# EAGLE schematic SIH (EAGLE 9.6.2)
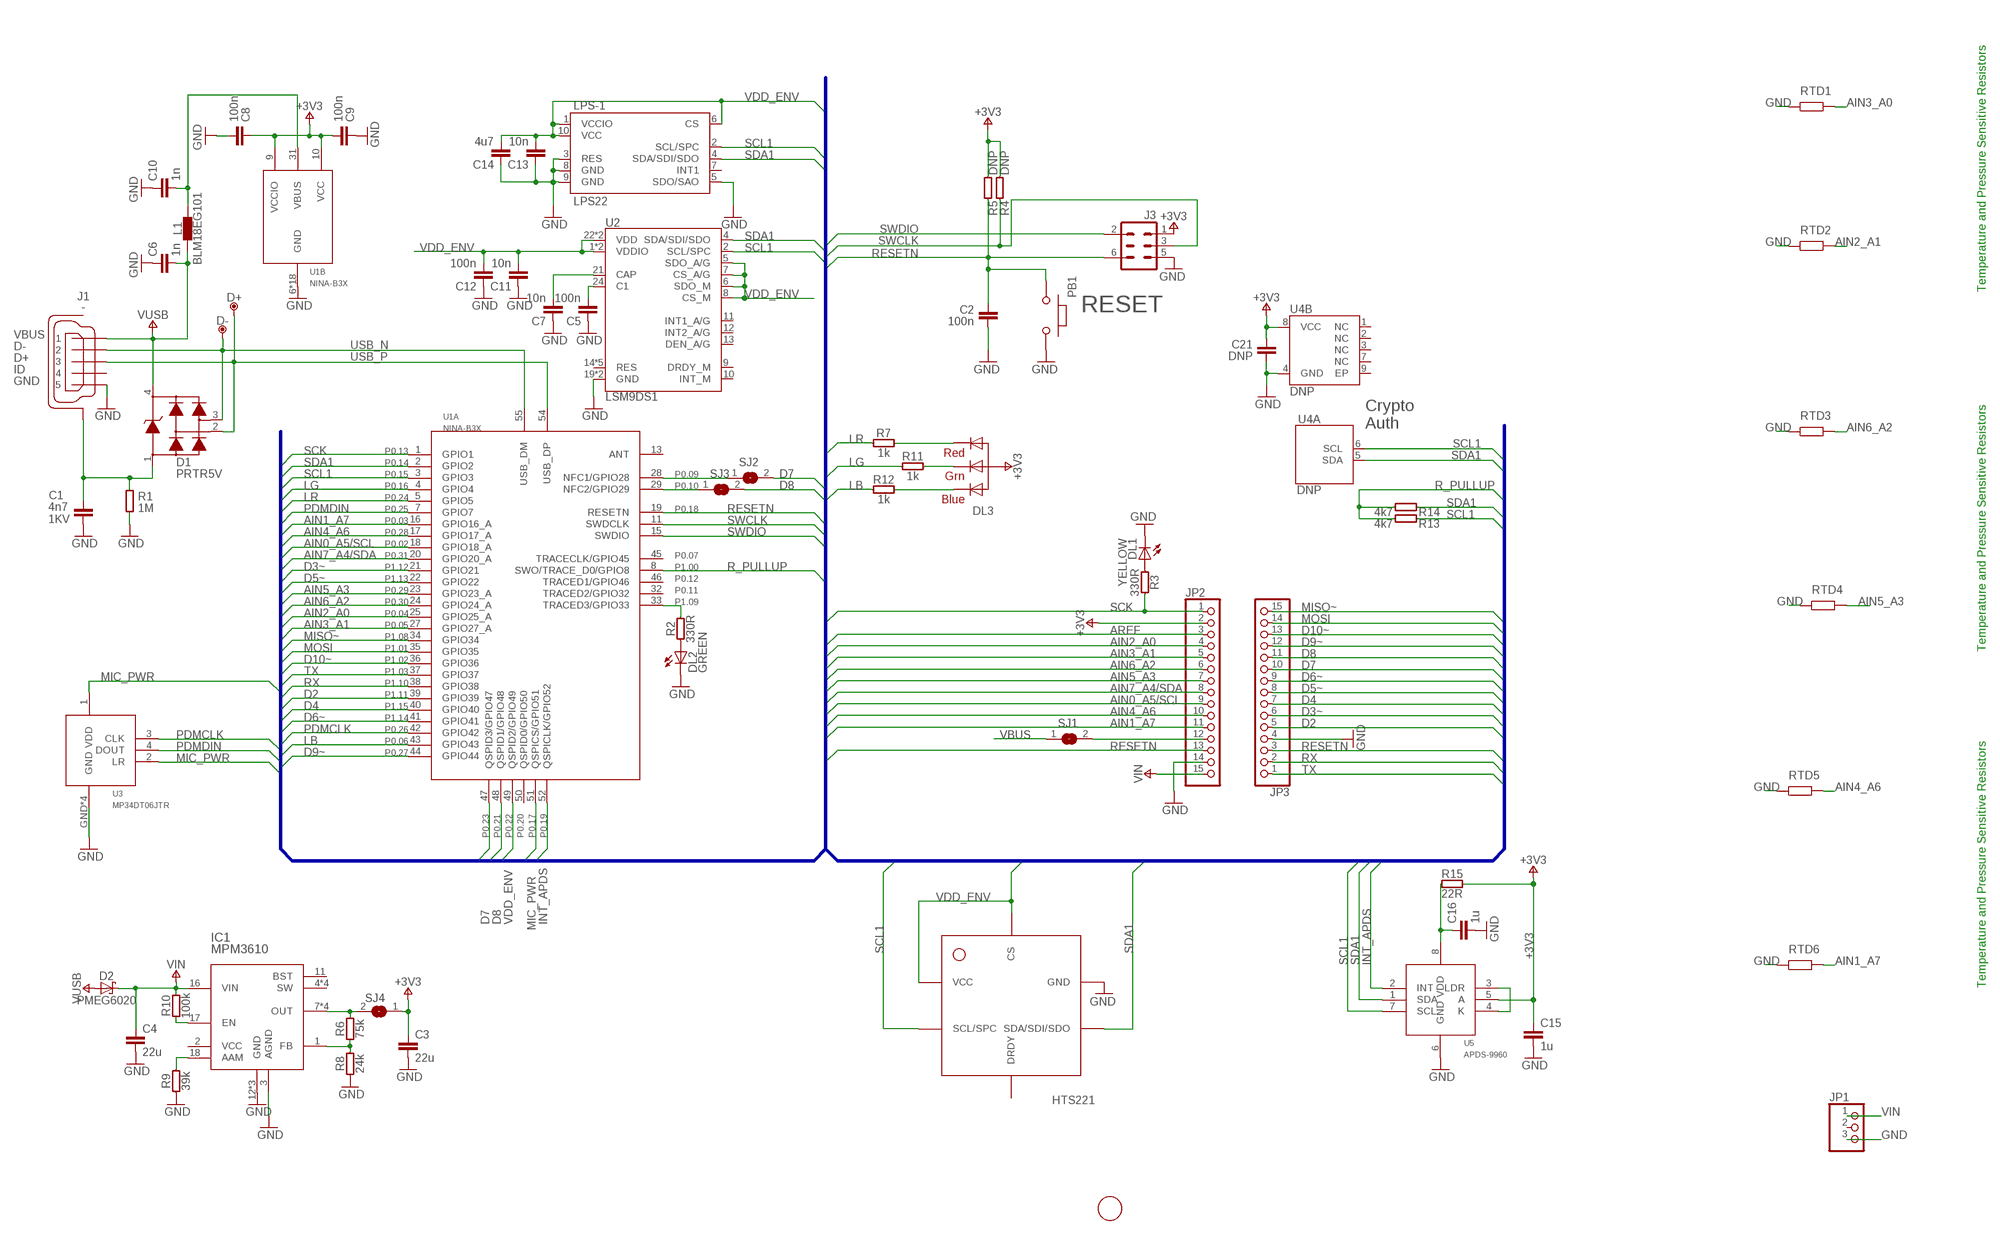
[diagram p0: schematic, sheet 1]

## Parts
C1  4n7  C4.7NF-0805  [0805-R2013X50N]
C2  100n  C-100NF-0402  [0402-1005X55N]
C3  22u  C-22U-0805  [0805-R2013X50N]
C4  22u  C-22U-0805  [0805-R2013X50N]
C5  100n  C-100NF-0402  [0402-1005X55N]
C6  1n  C-1NF-0402  [0402-1005X55N]
C7  10n  C-10NF-0402  [0402-1005X55N]
C8  100n  C-100NF-0402  [0402-1005X55N]
C9  100n  C-100NF-0402  [0402-1005X55N]
C10  1n  C-1NF-0402  [0402-1005X55N]
C11  10n  C-10NF-0402  [0402-1005X55N]
C12  100n  C-100NF-0402  [0402-1005X55N]
C13  10n  C-10NF-0402  [0402-1005X55N]
C14  4u7  C-4.7UF-0402  [0402-1005X55N]
C15  1u  C-1UF-0402  [0402-1005X55N]
C16  1u  C-1UF-0402  [0402-1005X55N]
C21  DNP  CDNP-0402  [0402-1005X55N]
D1  PRTR5V  PRTR5V0U2X,215  [SOT190P230X110-4N]
D2  PMEG6020  PMEG6020AELRX  [SODFL3517X110N]
D+  DNP  TPTP-1.00MM  [TP-1.00MM]
D-  DNP  TPTP-1.00MM  [TP-1.00MM]
DL1  YELLOW  LED-YELLOW-0603  [LEDC1608X80N-AK]
DL2  GREEN  LED-GREEN-0603  [LEDC1608X80N-AK]
DL3  -  RGBLED-KA  [SMLP34RGB2W]
FD1  DNP  FIDUCIAL-1.5MM  [FD-1-1.5]
HS-1  HTS221  [HTS221]
IC1  MPM3610  [MPM3610]
J1  -  USB-MICRO  [ZX62-AB-5PA]
J3  DNP  PINHD-2X03(NO4)  [2X03-TP1]
JP1  PINHD-1X3  [1X03]
JP2  PINHD-1X15-CASTELLATED  [1X15-CASTELL]
JP3  PINHD-1X15-CASTELLATED  [1X15-CASTELL]
L1  BLM18EG101  FERRITE-100R0603  [0603-1608X90N]
LPS-1  LPS22  LPS2XH-22  [LPS22H]
PB1  TACTILE3NO_SH  [C&K_PTS820_NO_SH]
R1  1M  R-1M-0402  [0402-1005X55N]
R2  330R  R-330R-0402  [0402-1005X55N]
R3  330R  R-330R-0402  [0402-1005X55N]
R4  DNP  R-DNP-0402  [0402-1005X55N]
R5  DNP  R-DNP-0402  [0402-1005X55N]
R6  75k  R-75K-0402  [0402-1005X55N]
R7  1k  R-1K-0402  [0402-1005X55N]
R8  24k  R-24K-0402  [0402-1005X55N]
R9  39k  R-39K-0402  [0402-1005X55N]
R10  100k  R-100K-0402  [0402-1005X55N]
R11  1k  R-1K-0402  [0402-1005X55N]
R12  1k  R-1K-0402  [0402-1005X55N]
R13  4k7  R-4K7-0402  [0402-1005X55N]
R14  4k7  R-4K7-0402  [0402-1005X55N]
R15  22R  R-22R-0402  [0402-1005X55N]
RTD1  R  (no package)
RTD2  R  (no package)
RTD3  R  (no package)
RTD4  R  (no package)
RTD5  R  (no package)
RTD6  R  (no package)
SJ1  DNP  SJ  [SJ]
SJ2  DNP  SJ  [SJ]
SJ3  DNP  SJ  [SJ]
SJ4  DNP  SJ  [SJ]
U1  NINA-B3X  [NINA-B3X]
U2  LSM9DS1  LSM9DS1_TEMP_LSM9DS1  [LSM9DS1_TEMP_LGA24-8X4]
U3  MP34DT06JTR  MP34DT06  [HCLGA]
U4  DNP  ATECC-DNP8-UDFN  [SON50P300X200X60-9N-EP160X140]
U5  APDS-9960  APDS9960  [APDS9960]

## Nets
+3V3: C3.1 C8.1 C9.2 C15.1 C21.1 DL3.1(A) J3.1 JP2.2 R4.2 R5.2 R15.2 SJ4.1 U1.9(B:VCCIO) U1.10(B:VCC) U4.8(B:VCC) U5.5(A)
AIN0_A5/SCL: JP2.9 U1.18(A:GPIO18_A)
AIN1_A7: JP2.11 RTD6.2 U1.16(A:GPIO16_A)
AIN2_A0: JP2.4 U1.25(A:GPIO25_A)
AIN2_A1: RTD2.2
AIN3_A0: RTD1.2
AIN3_A1: JP2.5 U1.27(A:GPIO27_A)
AIN4_A6: JP2.10 RTD5.2 U1.17(A:GPIO17_A)
AIN5_A3: JP2.7 RTD4.2 U1.23(A:GPIO23_A)
AIN6_A2: JP2.6 RTD3.2 U1.24(A:GPIO24_A)
AIN7_A4/SDA: JP2.8 U1.20(A:GPIO20_A)
AREF: JP2.3
D2: JP3.5 U1.39(A:GPIO39)
D3~: JP3.6 U1.21(A:GPIO21)
D4: JP3.7 U1.40(A:GPIO40)
D5~: JP3.8 U1.22(A:GPIO22)
D6~: JP3.9 U1.41(A:GPIO41)
D7: JP3.10 SJ2.2 U1.47(A:QSPID3/GPIO47)
D8: JP3.11 SJ3.2 U1.48(A:QSPID1/GPIO48)
D9~: JP3.12 U1.44(A:GPIO44)
D10~: JP3.13 U1.36(A:GPIO36)
GND: C1.2 C2.2 C3.2 C4.2 C5.1 C6.1 C7.1 C8.2 C9.1 C10.1 C11.1 C12.1 C13.1 C14.1 C15.2 C16.2 C21.2 DL1.C DL2.C HS-1.P$5.GND(GND) IC1.3(AGND) IC1.12(GND) IC1.13(GND) IC1.14(GND) J1.5 J3.5 JP1.3 JP2.14 JP3.4 LPS-1.3(RES) LPS-1.5(SDO/SAO) LPS-1.8(GND) LPS-1.9(GND) PB1.6 R1.1 R8.1 R9.1 RTD1.1 RTD2.1 RTD3.1 RTD4.1 RTD5.1 RTD6.1 U1.6(B:GND) U1.12(B:GND) U1.14(B:GND) U1.26(B:GND) U1.30(B:GND) U1.53(B:GND) U1.GND@1(B:GND) U1.GND@2(B:GND) U1.GND@3(B:GND) U1.GND@4(B:GND) U1.GND@5(B:GND) U1.GND@6(B:GND) U1.GND@7(B:GND) U1.GND@8(B:GND) U1.GND@9(B:GND) U1.GND@10(B:GND) U1.GND@11(B:GND) U1.GND@12(B:GND) U2.19(GND) U2.20(GND) U3.GND U3.GND@2(GND) U3.GND@3(GND) U3.GND@4(GND) U4.4(B:GND) U5.6(GND)
INT_APDS: U1.52(A:QSPICLK/GPIO52) U5.2(INT)
LB: R12.1 U1.43(A:GPIO43)
LG: R11.1 U1.4(A:GPIO4)
LR: R7.1 U1.5(A:GPIO5)
MIC_PWR: U1.51(A:QSPICS/GPIO51) U3.1(VDD) U3.2(LR)
MISO~: JP3.15 U1.34(A:GPIO34)
MOSI: JP3.14 U1.35(A:GPIO35)
N$1: C1.1 D1.1 J1.6(SH) J1.7(SH) J1.8(SH) J1.9(SH) J1.10(SH) J1.11(SH) R1.2
N$2: DL2.A R2.1
N$3: DL1.A R3.1
N$4: C5.2 U2.24(C1)
N$5: IC1.1(FB) R6.1 R8.2
N$6: IC1.18(AAM) R9.2
N$7: IC1.17(EN) R10.1
N$8: C7.2 U2.21(CAP)
N$9: U5.3(LDR) U5.4(K)
N$10: R2.2 U1.33(A:TRACED3/GPIO33)
N$11: DL3.3(BLUE_C) R12.2
N$12: DL3.2(RED_C) R7.2
N$13: DL3.4(GREEN_C) R11.2
N$14: JP2.12 SJ1.2
N$15: C16.1 R15.1 U5.8(VDD)
N$16: IC1.7(OUT) IC1.8(OUT) IC1.9(OUT) IC1.20(OUT) R6.2 SJ4.2
NFC1: SJ2.1 U1.28(A:NFC1/GPIO28)
NFC2: SJ3.1 U1.29(A:NFC2/GPIO29)
PDMCLK: U1.42(A:GPIO42) U3.3(CLK)
PDMDIN: U1.7(A:GPIO7) U3.4(DOUT)
R_PULLUP: R13.2 R14.2 U1.8(A:SWO/TRACE_D0/GPIO8)
RESETN: C2.1 J3.6 JP2.13 JP3.3 PB1.5 R5.1 U1.19(A:RESETN)
RX: JP3.2 U1.38(A:GPIO38)
SCK: JP2.1 R3.2 U1.1(A:GPIO1)
SCL1: HS-1.P$2.SCL/SPC(SCL/SPC) LPS-1.2(SCL/SPC) R13.1 U1.3(A:GPIO3) U2.2(SCL/SPC) U4.6(A:SCL) U5.7(SCL)
SDA1: HS-1.P$4.SDA/SDI/SDO(SDA/SDI/SDO) LPS-1.4(SDA/SDI/SDO) R14.1 U1.2(A:GPIO2) U2.4(SDA/SDI/SDO) U4.5(A:SDA) U5.1(SDA)
SWCLK: J3.3 R4.1 U1.11(A:SWDCLK)
SWDIO: J3.2 U1.15(A:SWDIO)
TX: JP3.1 U1.37(A:GPIO37)
USB_N [usb]: D1.3 D-.X J1.2 U1.55(A:USB_DM)
USB_P [usb]: D1.2 D+.X J1.3 U1.54(A:USB_DP)
VBUS: C10.2 L1.2 SJ1.1 U1.31(B:VBUS)
VDD_ENV: C11.2 C12.2 C13.2 C14.2 HS-1.P$1.VDD(VCC) HS-1.P$6.CS(CS) LPS-1.1(VCCIO) LPS-1.6(CS) LPS-1.10(VCC) U1.49(A:QSPID2/GPIO49) U2.1(VDDIO) U2.3(VDDIO) U2.5(SDO_A/G) U2.6(SDO_M) U2.7(CS_A/G) U2.8(CS_M) U2.22(VDD) U2.23(VDD)
VIN: C4.1 D2.C IC1.16(VIN) JP1.1 JP2.15 R10.2
VUSB: C6.2 D1.4 D2.A J1.1 L1.1
Unconnected: HS-1.P$3.DRDY(DRDY) IC1.2(VCC) IC1.4(SW) IC1.5(SW) IC1.6(SW) IC1.11(BST) IC1.19(SW) J1.4 JP1.2 LPS-1.7(INT1) U1.13(A:ANT) U1.32(A:TRACED2/GPIO32) U1.45(A:TRACECLK/GPIO45) U1.46(A:TRACED1/GPIO46) U1.50(A:QSPID0/GPIO50) U2.9(DRDY_M) U2.10(INT_M) U2.11(INT1_A/G) U2.12(INT2_A/G) U2.13(DEN_A/G) U2.14(RES) U2.15(RES) U2.16(RES) U2.17(RES) U2.18(RES) U4.1(B:NC) U4.2(B:NC) U4.3(B:NC) U4.7(B:NC) U4.9(B:EP)

## Buses
+3V3,+3V3D,A1,A6,A7,AIN0_A5/SCL,AIN1_A7,AIN2_A0,AIN3_A1,AIN4_A6,AIN5_A3,AIN6_A2,AIN7_A4/SDA,APDS_PWR,AREF,D2,D3~,D4,D5~,D6~,D7,D8,D9~,D10~,GND,INT_APDS,LB,LED_BLUE,LED_GREEN,LED_RED,LG,LR,MIC_PWR,MISO~,MOSI,NFC1,NFC2,PA12_S2_TX/MOSI,PA13_S2_RX/MISO,PA14_S2_RTS/CS,PA15_S2_CTS/SCK,PA22_TC4-W0,PA23_TC4-W1,PA27_GPIO0,PA28_ACK,PB08_RST,PB11_TCC0-W5,PDMCLK,PDMDIN,RESET#,RESETN,R_PULLUP,RSTN_NINA,RX,RX_NINA,SCK,SCL1,SDA1,SWCLK,SWDIO,TX,TX_NINA,USB_N,USB_P,VBUS,VDD_ENV,VIN,VUSB
+3V3,+3V3D,A1,A6,A7,AIN1_A7,AIN2_A0,AIN3_A1,AIN4_A6,AIN5_A3,AIN6_A2,APDS_PWR,AREF,D2,D3~,D4,D5~,D6~,D7,D8,D9~,D10~,GND,LB,LED_BLUE,LED_GREEN,LED_RED,LG,LR,MISO~,MOSI,N$1,N$2,N$3,N$4,N$5,N$6,N$7,N$8,N$10,N$11,N$12,N$13,NFC1,NFC2,PA12_S2_TX/MOSI,PA13_S2_RX/MISO,PA14_S2_RTS/CS,PA15_S2_CTS/SCK,PA27_GPIO0,PA28_ACK,PB08_RST,RESETN,R_PULLUP,RSTN_NINA,RX,RX_NINA,SCK,SCL1,SDA1,SWCLK,SWDIO,TX,TX_NINA,USB_N,USB_P,VBUS,VDD_ENV,VIN,VUSB

## Notes on the sheet
- Temperature and Pressure Sensitive Resistors
- RESET
- Crypto
  Auth
- Temperature and Pressure Sensitive Resistors
- Temperature and Pressure Sensitive Resistors
- HTS221

## Library data of the parts
C1 = Arduino-rcl:C: SMD Capacitor; CODE-ARDUINO: 0689; DATASHEET: http://www.kemet.com/Lists/ProductCatalog/Attachments/40/KEM_C1010_X7R_HV_SMD.pdf; DISTRIBUTOR-LINK: www.kemet.com/docfinder?Partnumber=C0805C472KDRACTU; DISTRIBUTOR-PN: 399-6738-1-ND; MANUFACTURER: Kemet; MANUFACTURER-PN: C0805C472KDRACTU; NOTE: -; VOLTAGE: 1KV
C2 C5 C8 C9 C12 = Arduino-rcl:C: SMD Capacitor; CODE-ARDUINO: 0132; DATASHEET: http://www.tdk.com/pdf/TDKMLCCCapRange.pdf; DISTRIBUTOR-LINK: http://www.digikey.com/product-detail/en/tdk-corporation/C1005X5R1H104K050BB/445-5942-1-ND/2443982; DISTRIBUTOR-PN: 445-5942-1-ND; MANUFACTURER: TDK; MANUFACTURER-PN: C1005X5R1H104K050BB; NOTE: -
C3 C4 = Arduino-rcl:C: SMD Capacitor; CODE-ARDUINO: 2233; DATASHEET: https://media.digikey.com/pdf/Data%20Sheets/Samsung%20PDFs/CL21A226MQCLQNC_character.pdf; DISTRIBUTOR-LINK: https://www.digikey.com/product-detail/en/samsung-electro-mechanics-america-inc/CL21A226MQCLQNC/1276-2412-1-ND/3890498; DISTRIBUTOR-PN: 1276-2412-1-ND; MANUFACTURER: Samsung; MANUFACTURER-PN: CL21A226MQCLQNC; NOTE: -
C6 C10 = Arduino-rcl:C: SMD Capacitor; CODE-ARDUINO: 2321; DATASHEET: http://www.samsungsem.com/kr/support/product-search/mlcc/__icsFiles/afieldfile/2016/08/18/S_CL05B102KB5NNNC.pdf; DISTRIBUTOR-LINK: http://www.digikey.com/product-detail/en/samsung-electro-mechanics-america-inc/CL05B102KB5NNNC/1276-1032-1-ND/3889118; DISTRIBUTOR-PN: 1276-1032-1-ND; MANUFACTURER: Samsung; MANUFACTURER-PN: CL05B102KB5NNNC; NOTE: -
C7 C11 C13 = Arduino-rcl:C: SMD Capacitor; CODE-ARDUINO: 0165; DATASHEET: http://search.murata.co.jp/Ceramy/image/img/A01X/partnumbering_e_01.pdf; DISTRIBUTOR-LINK: http://www.digikey.com/product-detail/en/murata-electronics-north-america/GRM155R71H103KA88J/490-6351-1-ND/3845548; DISTRIBUTOR-PN: 490-6351-1-ND; MANUFACTURER: Murata; MANUFACTURER-PN: GRM155R71H103KA88J; NOTE: -
C14 = Arduino-rcl:C: SMD Capacitor; CODE-ARDUINO: 0833; DATASHEET: http://search.murata.co.jp/Ceramy/image/img/A01X/partnumbering_e_01.pdf; DISTRIBUTOR-LINK: http://www.digikey.com/product-detail/en/murata-electronics-north-america/GRM155R60J475ME47D/490-5915-1-ND/3719860; DISTRIBUTOR-PN: 490-5915-1-ND; MANUFACTURER: Murata; MANUFACTURER-PN: GRM155R60J475ME47D; NOTE: -
C15 C16 = Arduino-rcl:C: SMD Capacitor; CODE-ARDUINO: 0133; DATASHEET: http://search.murata.co.jp/Ceramy/image/img/A01X/partnumbering_e_01.pdf; DISTRIBUTOR-LINK: http://www.digikey.com/product-detail/en/murata-electronics-north-america/GRM155R61E105KA12D/490-10017-1-ND/5026367; DISTRIBUTOR-PN: 490-10017-1-ND; MANUFACTURER: Murata; MANUFACTURER-PN: GRM155R61E105KA12D; NOTE: -
C21 = Arduino-rcl:C: SMD Capacitor; CODE-ARDUINO: DNP; DATASHEET: DNP; DISTRIBUTOR-LINK: DNP; DISTRIBUTOR-PN: DNP; MANUFACTURER: DNP; MANUFACTURER-PN: DNP; NOTE: DNP
D1 = Arduino-diodes:PRTR5V0U2X,215: USB ESD protection; CODE-ARDUINO: 2209; DATASHEET: http://www.nxp.com/documents/data_sheet/PRTR5V0U2X.pdf; DISTRIBUTOR-LINK: http://www.digikey.com/product-detail/en/nxp-semiconductors/PRTR5V0U2X,215/568-4140-1-ND/1589981; DISTRIBUTOR-PN: 568-4140-1-ND; MANUFACTURER: NXP; MANUFACTURER-PN: PRTR5V0U2X,215
D2 = Arduino-diodes:PMEG6020AELRX: 60 V, 2 A low leakage current Schottky barrier rectifier Datasheet <http://www.nxp.com/documents/data_sheet/PMEG6020AELR.pdf>; CODE-ARDUINO: 2208; DATASHEET: http://www.nxp.com/documents/data_sheet/PMEG6020AELR.pdf; DISTRIBUTOR-LINK: http://www.digikey.com/products/en?keywords=%20568-12710-1-ND; DISTRIBUTOR-PN: 568-12710-1-ND; MANUFACTURER: NXP; MANUFACTURER-PN: PMEG6020AELRX
D+ D- = Arduino-utility:TP: Testpoint; CODE-ARDUINO: DNP; DATASHEET: DNP; DISTRIBUTOR-LINK: DNP; DISTRIBUTOR-PN: DNP; MANUFACTURER: DNP; MANUFACTURER-PN: DNP
DL1 = Arduino-diodes:LED: LED; CODE-ARDUINO: 2243; DATASHEET: http://media.digikey.com/pdf/Data%20Sheets/Avago%20PDFs/HSMz-Czzz.pdf; DISTRIBUTOR-LINK: http://www.digikey.com/product-detail/en/broadcom-limited/HSMY-C190/516-1424-1-ND/637748; DISTRIBUTOR-PN: 516-1424-1-ND; MANUFACTURER: Avago; MANUFACTURER-PN: HSMY-C190
DL2 = Arduino-diodes:LED: LED; CODE-ARDUINO: 2204; DATASHEET: http://media.digikey.com/pdf/Data%20Sheets/Avago%20PDFs/HSMz-Czzz.pdf; DISTRIBUTOR-LINK: http://www.digikey.com/product-detail/en/broadcom-limited/HSMG-C190/516-1425-1-ND/637749; DISTRIBUTOR-PN: 516-1425-1-ND; MANUFACTURER: Avago; MANUFACTURER-PN: HSMG-C190
DL3 = Arduino-diodes:RGBLED-KA: 5050 RGB LED; DATASHEET: https://www.rohm.com/datasheet/SMLP34RGB2W; DISTRIBUTOR-LINK: https://www.digikey.com/product-detail/en/rohm-semiconductor/SMLP34RGB2W3/SMLP34RGB2W3CT-ND/2921110; DISTRIBUTOR-PN: SMLP34RGB2W3CT-ND; MANUFACTURER-PN: SMLP34RGB2W3
FD1 = Arduino-utility:FIDUCIAL: Fiducial mount; CODE-ARDUINO: DNP; DATASHEET: DNP; DISTRIBUTOR-LINK: DNP; DISTRIBUTOR-PN: DNP; MANUFACTURER: DNP; MANUFACTURER-PN: DNP
HS-1 = Arduino-Sensors:HTS221; CODE-ARDUINO: A5356; DATASHEET: https://nl.mouser.com/datasheet/2/389/hts221-954783.pdf; DISTRIBUTOR-LINK: https://nl.mouser.com/ProductDetail/STMicroelectronics/HTS221TR?qs=%2fha2pyFaduhYqhgVSCoMJjbIcKdCD1D5p03chi4OA3k%3d; DISTRIBUTOR-PN: 511-HTS221TR; MANUFACTURER: STMicroelectronics; MANUFACTURER-PN: HTS221TR
IC1 = Arduino-ICs:MPM3610: MPM3610 Step Down Regulator; CODE-ARDUINO: 2093; DATASHEET: https://www.monolithicpower.com/pub/media/document/MPM3610_r1.01.pdf; DISTRIBUTOR-LINK: https://www.digikey.com/product-detail/en/monolithic-power-systems-inc/MPM3610AGQV-P/1589-1249-1-ND/5298336; DISTRIBUTOR-PN: 1589-1249-1-ND; MANUFACTURER: MPS; MANUFACTURER-PN: MPM3610AGQV-P; RESTRICTIONS: NO
J1 = Arduino-connectors:USB-MICRO: USB - micro AB USB 2.0 Receptacle Connector 5 Position Surface Mount, Right Angle, Horizontal; CODE-ARDUINO: 2219; DATASHEET: https://www.hirose.com/product/en/download_file/key_name/ZX/category/Catalog/doc_file_id/31704/?file_category_id=4&item_id=13&is_series=1; DISTRIBUTOR-LINK: http://www.digikey.com/product-detail/en/hirose-electric-co-ltd/ZX62-AB-5PA(31)/H125279CT-ND/5994741; DISTRIBUTOR-PN: H125279CT-ND; MANUFACTURER: Hirose; MANUFACTURER-PN: ZX62-AB-5PA(31)
J3 = Arduino-connectors:PINHD-2X03(NO4): PIN HEADER; CODE-ARDUINO: DNP; DATASHEET: DNP; DISTRIBUTOR-LINK: DNP; DISTRIBUTOR-PN: DNP; MANUFACTURER: DNP; MANUFACTURER-PN: DNP
JP1 = adafruit:PINHD-1X3: PIN HEADER
JP2 JP3 = Arduino-connectors:PINHD-1X15: PIN HEADER
L1 = Arduino-rcl:FERRITE: SMD ferrite; CODE-ARDUINO: -; DATASHEET: http://www.murata.com/en-us/products/productdata/8796747366430/ENFA0021.pdf; DISTRIBUTOR-LINK: https://www.digikey.com/product-detail/en/murata-electronics-north-america/BLM18EG101TN1D/490-5978-1-ND/3845178; DISTRIBUTOR-PN: 490-5978-1-ND; MANUFACTURER: Murata; MANUFACTURER-PN: BLM18EG101TN1D; NOTE: -
LPS-1 = Arduino-Sensors:LPS2XH; CODE-ARDUINO: A5390; DATASHEET: https://www.st.com/content/ccc/resource/technical/document/datasheet/bf/c1/4f/23/61/17/44/8a/DM00140895.pdf/files/DM00140895.pdf/jcr:content/translations/en.DM00140895.pdf; DISTRIBUTOR-LINK: https://www.digikey.com/product-detail/en/stmicroelectronics/LPS22HBTR/497-16265-1-ND/5799917; DISTRIBUTOR-PN: 497-16265-1-ND; MANUFACTURER: ST; MANUFACTURER-PN: LPS22HBTR
PB1 = Arduino-pushbuttons:TACTILE3
R1 = Arduino-rcl:R: SMD Resistor; CODE-ARDUINO: 0139; DATASHEET: www.yageo.com.tw/exep/pages/download/literatures/PYu-R_INT-thick_7.pdf; DISTRIBUTOR-LINK: http://www.digikey.com/product-detail/en/yageo/RC0402JR-07330RL/311-330JRCT-ND/729412; DISTRIBUTOR-PN: 311-330JRCT-ND; MANUFACTURER: Yageo; MANUFACTURER-PN: RC0402JR-07330RL; NOTE: NO
R2 R3 = Arduino-rcl:R: SMD Resistor; CODE-ARDUINO: 2229; DATASHEET: www.yageo.com.tw/exep/pages/download/literatures/PYu-R_INT-thick_7.pdf; DISTRIBUTOR-LINK: http://www.digikey.com/product-detail/en/yageo/RC0402FR-07330RL/311-330LRCT-ND/729541; DISTRIBUTOR-PN: 311-330LRCT-ND; MANUFACTURER: Yageo; MANUFACTURER-PN: RC0402FR-07330RL; NOTE: NO
R4 R5 = Arduino-rcl:R: SMD Resistor; CODE-ARDUINO: DNP; DATASHEET: DNP; DISTRIBUTOR-LINK: DNP; DISTRIBUTOR-PN: DNP; MANUFACTURER: DNP; MANUFACTURER-PN: DNP; NOTE: NO
R6 = Arduino-rcl:R: SMD Resistor; CODE-ARDUINO: A5480; DATASHEET: www.yageo.com.tw/exep/pages/download/literatures/PYu-R_INT-thick_7.pdf; DISTRIBUTOR-LINK: https://www.digikey.com/products/en?keywords=%20AC0402JR-0775KL; DISTRIBUTOR-PN: AC0402JR-0775KL-ND; MANUFACTURER: Yageo; MANUFACTURER-PN: AC0402JR-0775KL; NOTE: NO
R7 R11 R12 = Arduino-rcl:R: SMD Resistor; CODE-ARDUINO: 0140; DATASHEET: www.yageo.com.tw/exep/pages/download/literatures/PYu-R_INT-thick_7.pdf; DISTRIBUTOR-LINK: http://www.digikey.com/product-detail/en/yageo/RC0402FR-071KL/311-1.00KLRCT-ND/729460; DISTRIBUTOR-PN: 311-1.00KLRCT-ND; MANUFACTURER: Yageo; MANUFACTURER-PN: RC0402FR-071KL; NOTE: NO
R8 = Arduino-rcl:R: SMD Resistor; CODE-ARDUINO: A5478; DATASHEET: http://www.yageo.com/NewPortal/yageodocoutput?fileName=/pdf/R-Chip/PYu-AC_51_RoHS_L_6.pdf; DISTRIBUTOR-LINK: https://www.digikey.com/products/en?keywords=AC0402JR-0724KL; DISTRIBUTOR-PN: AC0402JR-0724KL-ND; MANUFACTURER: Yageo; MANUFACTURER-PN: AC0402JR-0724KL; NOTE: NO
R9 = Arduino-rcl:R: SMD Resistor; CODE-ARDUINO: A5479; DATASHEET: www.yageo.com.tw/exep/pages/download/literatures/PYu-R_INT-thick_7.pdf; DISTRIBUTOR-LINK: https://www.digikey.com/product-detail/en/yageo/RC0402JR-0739KL/311-39KJRCT-ND/729420; DISTRIBUTOR-PN: 311-39KJRCT-ND; MANUFACTURER: Yageo; MANUFACTURER-PN: RC0402JR-0739KL; NOTE: NO
R10 = Arduino-rcl:R: SMD Resistor; CODE-ARDUINO: 0134; DATASHEET: www.yageo.com.tw/exep/pages/download/literatures/PYu-R_INT-thick_7.pdf; DISTRIBUTOR-LINK: http://www.digikey.com/product-detail/en/yageo/RC0402FR-07100KL/311-100KLRCT-ND/729473; DISTRIBUTOR-PN: 311-100KLRCT-ND; MANUFACTURER: Yageo; MANUFACTURER-PN: RC0402FR-07100KL; NOTE: NO
R13 R14 = Arduino-rcl:R: SMD Resistor; CODE-ARDUINO: 2196; DATASHEET: www.yageo.com.tw/exep/pages/download/literatures/PYu-R_INT-thick_7.pdf; DISTRIBUTOR-LINK: http://www.digikey.com/product-detail/en/yageo/RC0402FR-074K7L/311-4.7KLRCT-ND/2827881; DISTRIBUTOR-PN: 311-4.7KLRCT-ND; MANUFACTURER: Yageo; MANUFACTURER-PN: RC0402FR-074K7L; NOTE: NO
R15 = Arduino-rcl:R: SMD Resistor; CODE-ARDUINO: 0468; DATASHEET: www.yageo.com.tw/exep/pages/download/literatures/PYu-R_INT-thick_7.pdf; DISTRIBUTOR-LINK: http://www.digikey.com/products/en?keywords=311-22.0LRCT-ND; DISTRIBUTOR-PN: 311-22.0LRCT-ND; MANUFACTURER: Yageo; MANUFACTURER-PN: RC0402FR-0722RL; NOTE: NO
RTD1-RTD6 = ngspice-simulation:R: RESISTOR
SJ1-SJ4 = Arduino-utility:SJ: SMD solder JUMPER; CODE-ARDUINO: DNP; DATASHEET: DNP; DISTRIBUTOR-LINK: DNP; DISTRIBUTOR-PN: DNP; MANUFACTURER: DNP; MANUFACTURER-PN: DNP
U1 = Arduino-ucs&SoCs:NINA-B3X: UBLOX BLE module
U2 = Arduino-ICs:LSM9DS1_TEMP_LSM9DS1: LSM9DS1 3D accelerometer, gyroscope & magnetometer The LSM9DS1 is a system-in-package featuring a 3D digital linear acceleration sensor, a 3D digital angular rate sensor, and a 3D digital magnetic sensor. The LSM9DS1 has a linear acceleration full scale of ±2g/±4g/±8/±16 g, a magnetic field full scale of ±4/±8/±12/±16 gauss and an angular rate of ±245/±500/±2000 dps. The LSM9DS1 includes an I2 C serial bus interface supporting standard and fast mode (100 kHz and 400 kHz) and an SPI serial standard interface. Magnetic, accelerometer and gyroscope sensing can be enabled or set in power-down mode separately for smart power management. The LSM9DS1 is available in a plastic land grid array package (LGA) and it is guaranteed to operate over an extended temperature range from -40 °C to +85 °C.; CODE-ARDUINO: A5430; DATASHEET: https://www.st.com/content/ccc/resource/technical/document/datasheet/1e/3f/2a/d6/25/eb/48/46/DM00103319.pdf/files/DM00103319.pdf/jcr:content/translations/en.DM00103319.pdf; DISTRIBUTOR-LINK: https://www.digikey.com/product-detail/en/stmicroelectronics/LSM9DS1TR/497-14946-1-ND/4988079; DISTRIBUTOR-PN: 497-14946-1-ND; MANUFACTURER: ST; MANUFACTURER-PN: LSM9DS1TR; NOTE: NO
U3 = Arduino-Sensors:MP34DT06; CODE-ARDUINO: A5470; DATSHEET: https://www.st.com/resource/en/datasheet/mp34dt06j.pdf; DISTRIBUTOR-LINK: https://www.digikey.com/product-detail/en/stmicroelectronics/MP34DT06JTR/497-18180-1-ND/9605997; DISTRIBUTOR-PN: 497-18180-1-ND; MANUFACTURER-PN: MP34DT06JTR
U4 = Arduino-ICs:ATECC: Secure authentication and product validation device, EEPROM, I2C, 2.0 - 5.5V; CODE-ARDUINO: DNP; DATASHEET: DNP; DISTRIBUTOR-LINK: DNP; DISTRIBUTOR-PN: DNP; MANUFACTURER: DNP; MANUFACTURER-PN: DNP; NOTE: DNP
U5 = Arduino-Sensors:APDS9960; CODE-ARDUINO: A5475; DATASHEET: https://docs.broadcom.com/docs/AV02-4191EN; DISTRIBUTOR-LINK: https://www.digikey.com/product-detail/en/broadcom-limited/APDS-9960/516-3480-1-ND/6677150; DISTRIBUTOR-PN: 516-3480-1-ND; MANUFACTURER: Broadcom; MANUFACTURER-PN: APDS-9960; NOTE: NO

## Net classes
0 default: width 0.19 mm, drill 0.19 mm
1 usb: width 0.19 mm, drill 0.19 mm